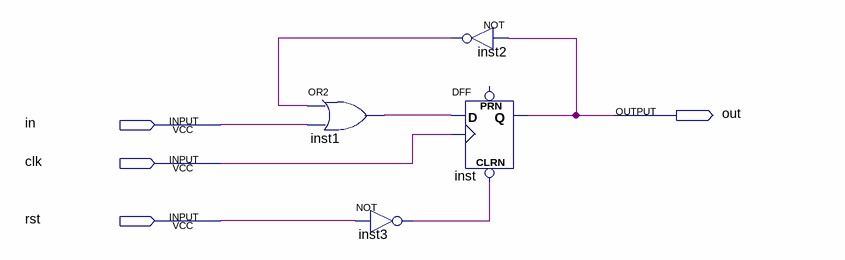
[diagram p0: schematic sheet]
// Quartus schematic TOP.bdf as structural Verilog: 4 symbols, 4 pins
module TOP (
  input  in,
  input  clk,
  input  rst,
  output out
);

  wire inst1_out, inst2_out, inst3_out;

  or inst1 (inst1_out, inst2_out, in);
  not inst3 (inst3_out, rst);
  not inst2 (inst2_out, out);
  DFF inst (.CLRN(inst3_out), .CLK(clk), .D(inst1_out), .Q(out));  // open: PRN
endmodule
